# EAGLE schematic frankShield (EAGLE 7.5.0)
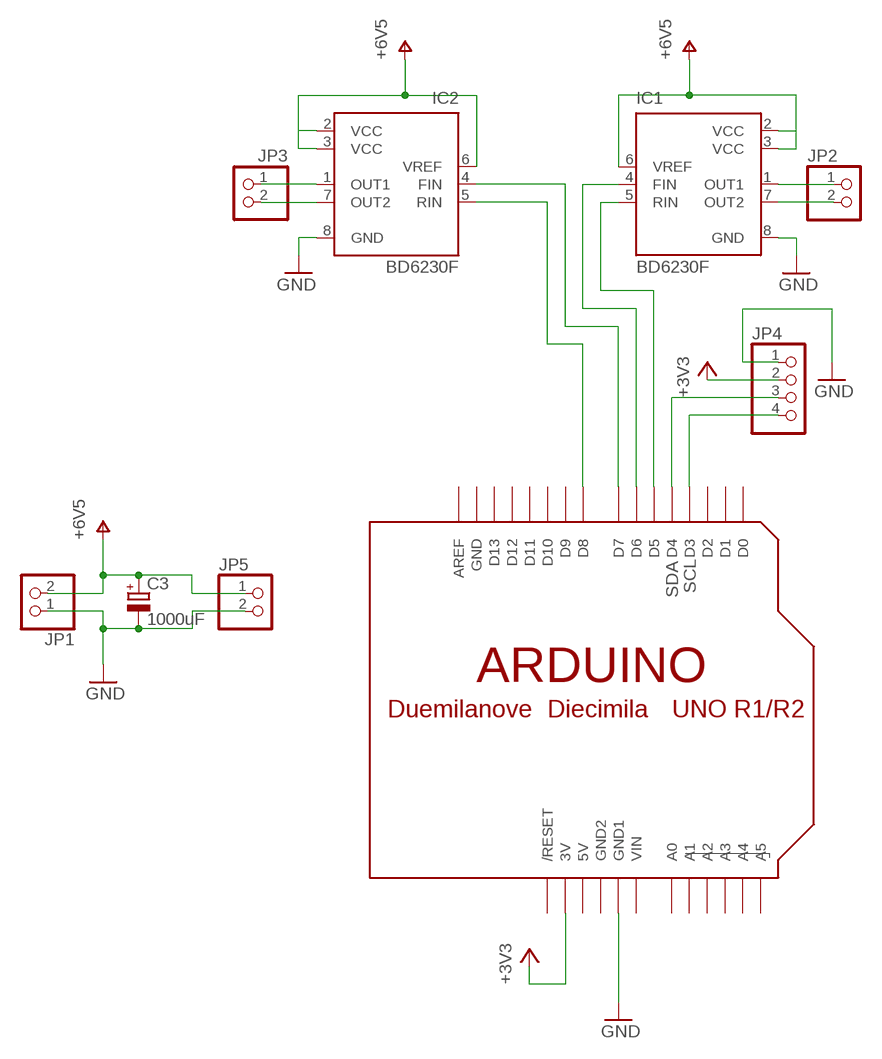
[diagram p0: schematic, sheet 1]

## Parts
C3  1000uF  CPOL-EUB45181B  [B45181B]
IC1  BD6230F  [SOP8]
IC2  BD6230F  [SOP8]
JP1  PINHD-1X2  [1X02]
JP2  PINHD-1X2  [1X02]
JP3  PINHD-1X2  [1X02]
JP4  PINHD-1X4  [1X04]
JP5  PINHD-1X2  [1X02]
U$1  ARDUINO-BPLACE  [ARDUINO-BPLACE]

## Nets
+3V3: JP4.2 U$1.3V
GND: C3.- IC1.8(GND) IC2.8(GND) JP1.1 JP4.1 JP5.2 U$1.GND1
N$1: JP4.4 U$1.D3
N$2: JP4.3 U$1.D4
N$3: IC1.1(OUT1) JP2.1
N$4: IC1.7(OUT2) JP2.2
N$5: IC2.1(OUT1) JP3.1
N$6: IC2.7(OUT2) JP3.2
N$7: IC1.5(RIN) U$1.D5
N$8: IC1.4(FIN) U$1.D6
N$9: IC2.4(FIN) U$1.D7
N$10: IC2.5(RIN) U$1.D8
V+: C3.+ IC1.2(VCC) IC1.3(VCC) IC1.6(VREF) IC2.2(VCC) IC2.3(VCC) IC2.6(VREF) JP1.2 JP5.1 ; supply symbol labelled +6V5
Unconnected: U$1.A0 U$1.A1 U$1.A2 U$1.A3 U$1.A4 U$1.A5 U$1.AREF U$1.D0 U$1.D1 U$1.D2 U$1.D9 U$1.D10 U$1.D11 U$1.D12 U$1.D13 U$1.RESET(/RESET)

## Notes on the sheet
- SDA | SCL

## Power pins joined to a net without a drawn wire
5V: U$1.5V
GND: U$1.GND
GND2: U$1.GND2
VIN: U$1.VIN

## Library data of the parts
C3 = rcl:CPOL-EU: POLARIZED CAPACITOR, European symbol
IC1 IC2 = rohm:BD623*F: H-bridge driver for brush motors Source: http://www.rohm.com/products/databook/motor/pdf/bd623x_series-e.pdf; MPN: BD6230F-E2; OC_FARNELL: 1716264; OC_NEWARK: 15R0529
JP1-JP3 JP5 = pinhead:PINHD-1X2: PIN HEADER
JP4 = pinhead:PINHD-1X4: PIN HEADER
U$1 = adafruit:ARDUINO: Arduino Diecimila/Duemilanove Make a shield with ease, this package has all the named pins as well as the two mounting drill holes and an outline of the USB and DC power connector. The outline is on the DIMENSION layer, so if your board house uses it they will cut the outline to match. http://www.ladyada.net/library/pcb/eaglelibrary.html